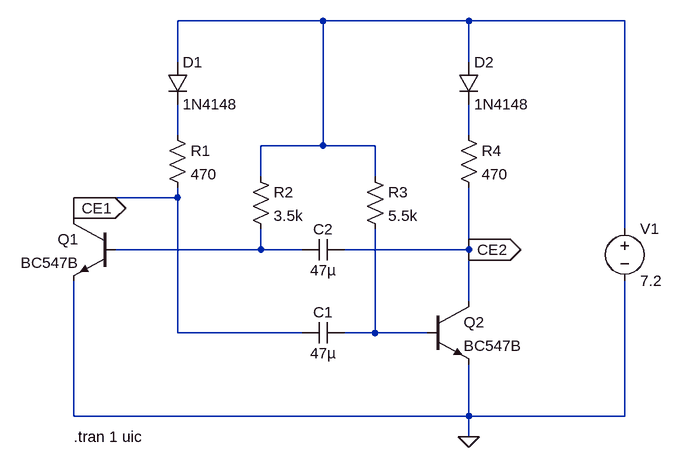
[diagram p0: schematic MULT_1.asc]
MULT_1.asc, the LTspice schematic file:
Version 4.1
SHEET 1 880 680
WIRE 0 -192 -224 -192
WIRE 224 -192 0 -192
WIRE 464 -192 224 -192
WIRE -224 -128 -224 -192
WIRE 224 -128 224 -192
WIRE -224 -16 -224 -64
WIRE 224 -16 224 -64
WIRE 0 0 0 -192
WIRE 0 0 -96 0
WIRE 80 0 0 0
WIRE -96 48 -96 0
WIRE 80 48 80 0
WIRE -224 80 -224 64
WIRE -224 80 -384 80
WIRE -384 96 -384 80
WIRE -384 112 -384 96
WIRE 464 128 464 -192
WIRE -96 160 -96 128
WIRE -96 160 -320 160
WIRE -32 160 -96 160
WIRE 224 160 224 64
WIRE 224 160 32 160
WIRE 224 240 224 160
WIRE -224 288 -224 80
WIRE -32 288 -224 288
WIRE 80 288 80 128
WIRE 80 288 32 288
WIRE 160 288 80 288
WIRE -384 416 -384 208
WIRE 224 416 224 336
WIRE 224 416 -384 416
WIRE 464 416 464 208
WIRE 464 416 224 416
WIRE 224 448 224 416
FLAG -384 96 CE1
IOPIN -384 96 Out
FLAG 224 160 CE2
IOPIN 224 160 Out
FLAG 224 448 0
SYMBOL voltage 464 112 R0
WINDOW 123 0 0 Left 0
WINDOW 39 24 124 Left 2
SYMATTR InstName V1
SYMATTR Value 7.2
SYMBOL diode -240 -128 R0
SYMATTR InstName D1
SYMATTR Value 1N4148
SYMBOL diode 208 -128 R0
SYMATTR InstName D2
SYMATTR Value 1N4148
SYMBOL res -240 -32 R0
SYMATTR InstName R1
SYMATTR Value 470
SYMBOL res -112 32 R0
SYMATTR InstName R2
SYMATTR Value 3.5k
SYMBOL res 64 32 R0
SYMATTR InstName R3
SYMATTR Value 5.5k
SYMBOL res 208 -32 R0
SYMATTR InstName R4
SYMATTR Value 470
SYMBOL cap 32 272 R90
WINDOW 0 0 32 VBottom 2
WINDOW 3 32 32 VTop 2
SYMATTR InstName C1
SYMATTR Value 47µ
SYMBOL cap 32 144 R90
WINDOW 0 0 32 VBottom 2
WINDOW 3 32 32 VTop 2
SYMATTR InstName C2
SYMATTR Value 47µ
SYMBOL npn -320 112 M0
SYMATTR InstName Q1
SYMATTR Value BC547B
SYMBOL npn 160 240 R0
SYMATTR InstName Q2
SYMATTR Value BC547B
TEXT -384 448 Left 2 !.tran 1 uic

The netlist it stands for:
* MULT_1.asc
V1 N001 0 7.2
D1 N001 N002 1N4148
D2 N001 N003 1N4148
R1 N002 CE1 470
R2 N001 N004 3.5k
R3 N001 N005 5.5k
R4 N003 CE2 470
C1 N005 CE1 47µ
C2 CE2 N004 47µ
Q1 CE1 N004 0 0 BC547B
Q2 CE2 N005 0 0 BC547B
.model D D
.lib standard.dio
.model NPN NPN
.model PNP PNP
.lib standard.bjt
.tran 1 uic
.backanno
.end